# EAGLE design main (EAGLE 7.6.0)
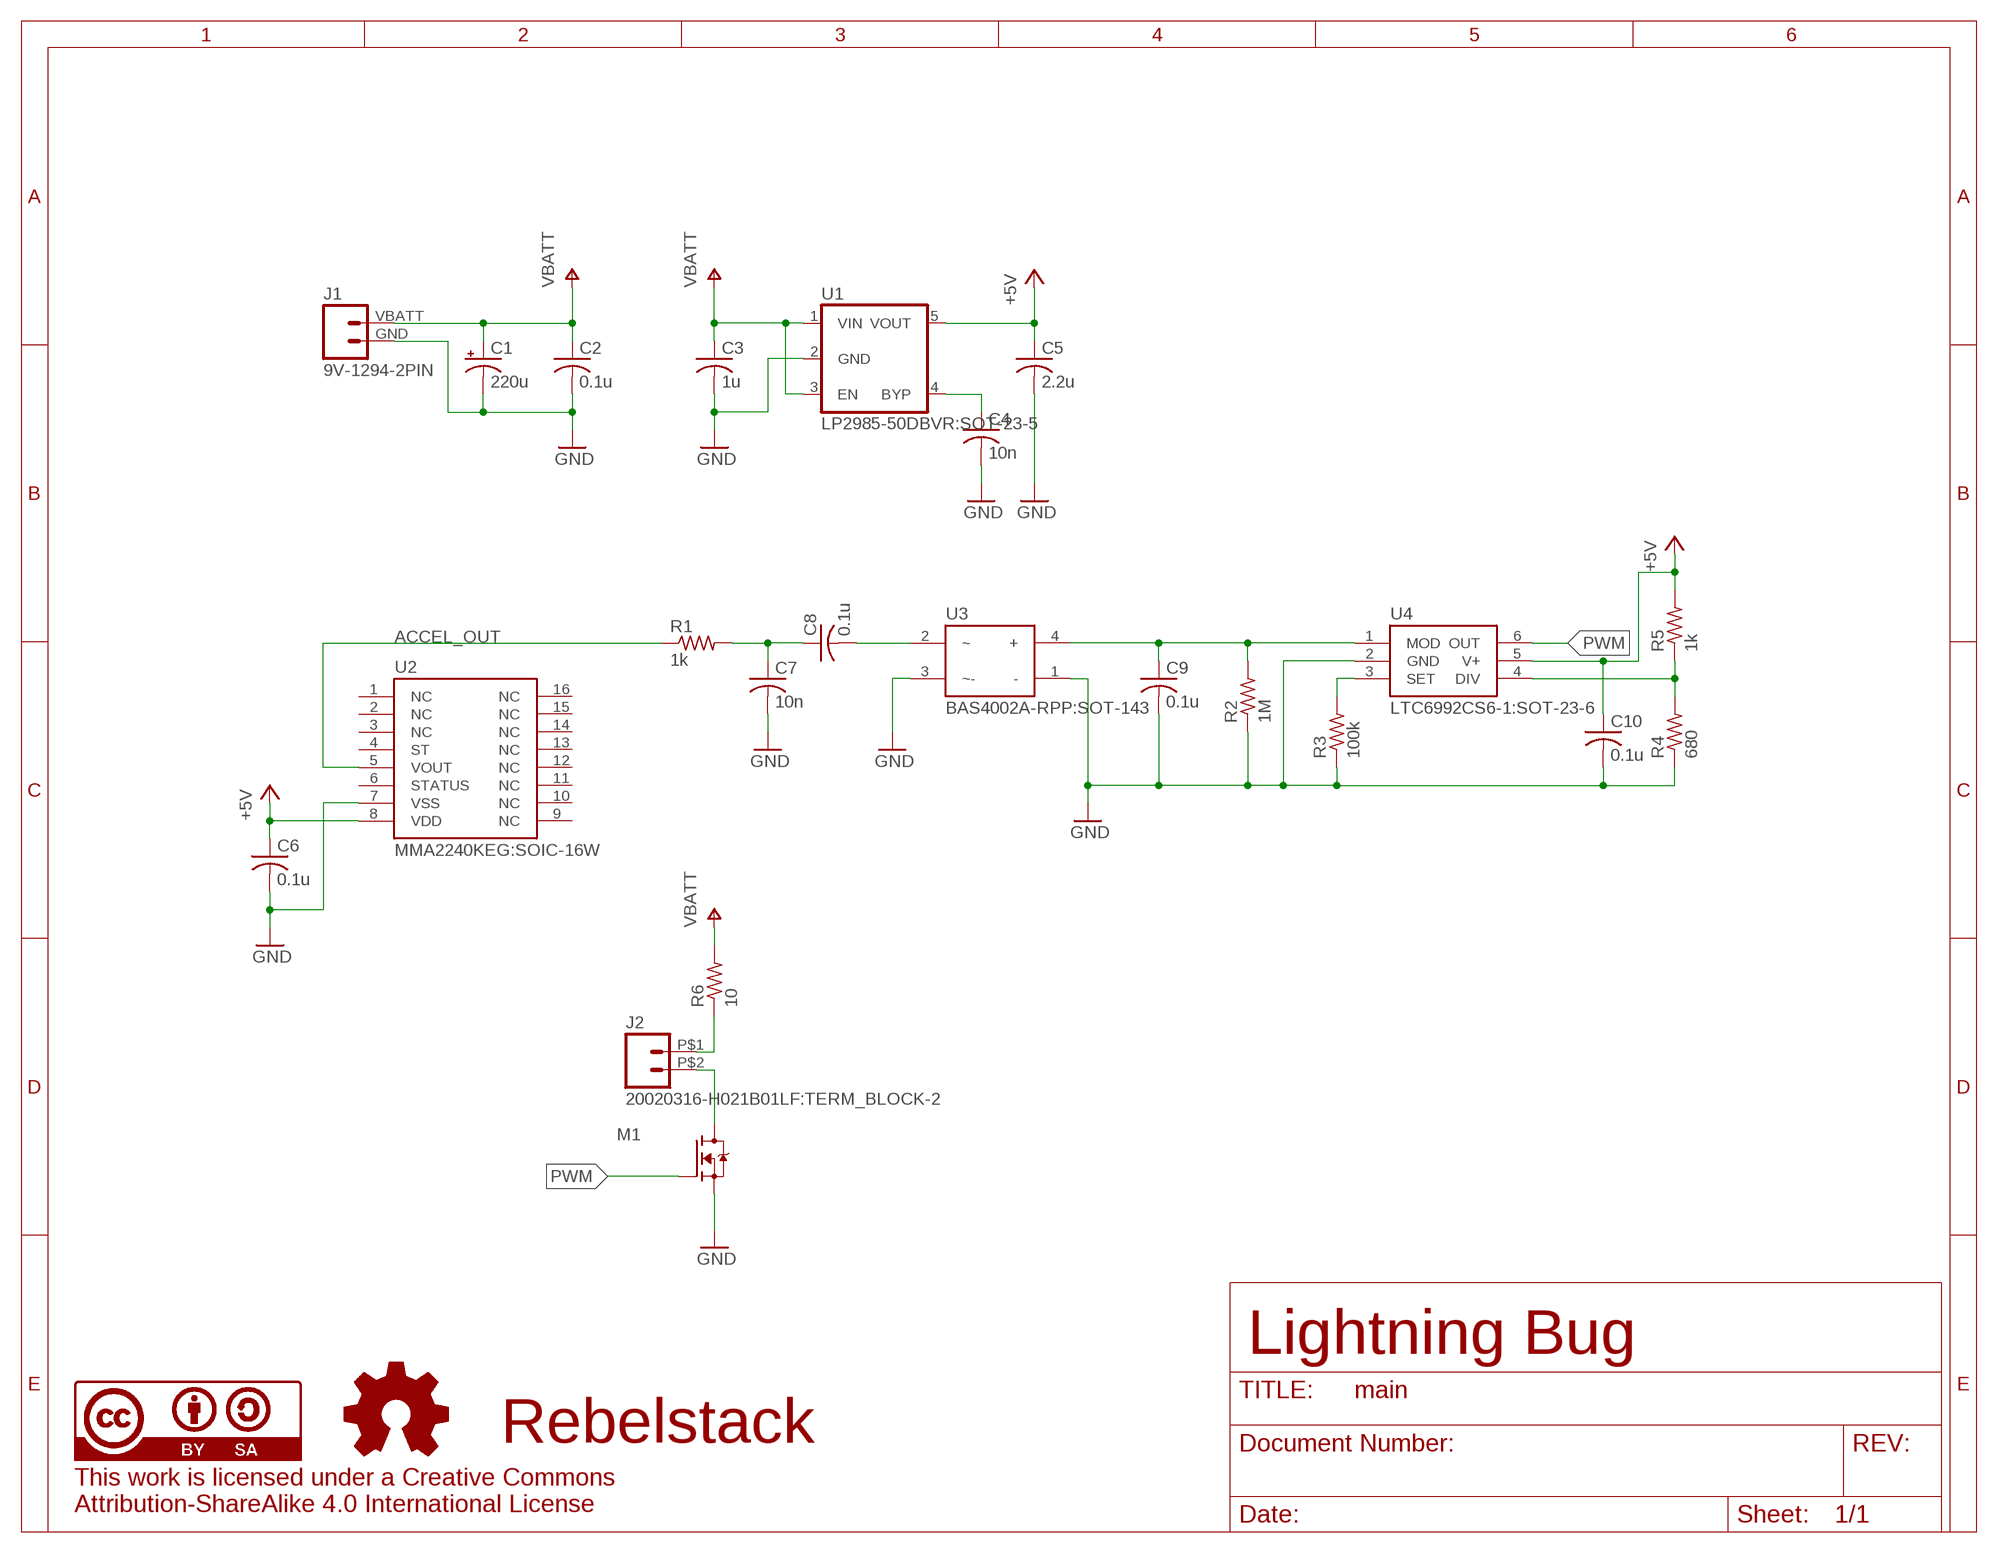
[diagram p0: schematic, sheet 1]

## Parts
C1  220u  CPOL-USD/7343-31W  [D/7343-31W]
C2  0.1u  C-USC0805  [C0805]
C3  1u  C-USC0805  [C0805]
C4  10n  C-USC0805  [C0805]
C5  2.2u  C-USC0805  [C0805]
C6  0.1u  C-USC0805  [C0805]
C7  10n  C-USC0805  [C0805]
C8  0.1u  C-USC0805  [C0805]
C9  0.1u  C-USC0805  [C0805]
C10  0.1u  C-USC0805  [C0805]
J1  9V-1294-2PIN  [9V-THRU]
J2  20020316-H021B01LF:TERM_BLOCK-2  [TERM_BLOCK-2]
M1  IRLML2502TRPBF:SOT-23-3  [SOT-23-3]
R1  1k  R-US_M0805  [M0805]
R2  1M  R-US_M0805  [M0805]
R3  100k  R-US_M0805  [M0805]
R4  680  R-US_M0805  [M0805]
R5  1k  R-US_M0805  [M0805]
R6  10  R-US_R2512  [R2512]
U1  LP2985-50DBVR:SOT-23-5  [SOT-23-5]
U2  MMA2240KEG:SOIC-16W  [SOIC-16W]
U3  BAS4002A-RPP:SOT-143  [SOT-143]
U4  LTC6992CS6-1:SOT-23-6  [SOT-23-6]
U$4  CC-BY-SA-4.0-INT-PCB  [CC-BY-SA-4.0-INT]
U$5  OSHW-LOGO-PCB  [OSHW-LOGO]

## Nets
+5V: C5.1 C6.1 C10.1 R5.2 U1.5(VOUT) U2.8(VDD) U4.5(V+)
ACCEL_OUT: R1.1 U2.5(VOUT)
GND: C1.- C2.2 C3.2 C4.2 C5.2 C6.2 C7.2 C9.2 C10.2 J1.GND M1.2(S) R2.1 R3.1 R4.1 U1.2(GND) U2.7(VSS) U3.1(-) U3.3(~-) U4.2(GND)
N$1: C4.1 U1.4(BYP)
N$2: C8.2 U3.2(~)
N$3: C9.1 R2.2 U3.4(+) U4.1(MOD)
N$4: R4.2 R5.1 U4.4(DIV)
N$5: C7.1 C8.1 R1.2
N$6: J2.P$1 R6.1
N$7: R3.2 U4.3(SET)
N$8: J2.P$2 M1.3(D)
PWM: M1.1(G) U4.6(OUT)
VBATT: C1.+ C2.1 C3.1 J1.VBATT R6.2 U1.1(VIN) U1.3(EN)
Unconnected: U2.1(NC) U2.2(NC) U2.3(NC) U2.4(ST) U2.6(STATUS) U2.9(NC) U2.10(NC) U2.11(NC) U2.12(NC) U2.13(NC) U2.14(NC) U2.15(NC) U2.16(NC)

## Notes on the sheet
- Lightning Bug
- Rebelstack

## Library data of the parts
C1 = rcl:CPOL-US: POLARIZED CAPACITOR, American symbol; DISTRIBUTOR: Digi-key; DISTRIBUTOR_PN: 399-10429-1-ND
C2 C6 C8-C10 = rcl:C-US: CAPACITOR, American symbol; DISTRIBUTOR: Digi-key; DISTRIBUTOR_PN: 1276-1007-1-ND
C3 = rcl:C-US: CAPACITOR, American symbol; DISTRIBUTOR: Digi-key; DISTRIBUTOR_PN: 1276-1066-1-ND
C4 C7 = rcl:C-US: CAPACITOR, American symbol; DISTRIBUTOR: Digi-key; DISTRIBUTOR_PN: 311-1136-1-ND
C5 = rcl:C-US: CAPACITOR, American symbol; DISTRIBUTOR: Digi-key; DISTRIBUTOR_PN: 445-1420-1-ND
J1 = rebelStack:9V-1294-2PIN: 9V Battery Holder, Thru-hole; DISTRIBUTOR: Digi-key; DISTRIBUTOR_PN: 36-1294-ND
J2 = rebelStack:20020316-H021B01LF:TERM_BLOCK-2: 2-Lead Terminal Block, Amphenol FCI, 0.2" Pitch, RA; DISTRIBUTOR: Digi-key; DISTRIBUTOR_PN: 609-3936-ND
M1 = rebelStack:IRLML2502TRPBF:SOT-23-3: N-Channel MOSFET, 20V, 4.2A, SOT-23; DISTRIBUTOR: Digi-key; DISTRIBUTOR_PN: IRLML2502PBFCT-ND
R1 R5 = rcl:R-US_: RESISTOR, American symbol; DISTRIBUTOR: Digi-key; DISTRIBUTOR_PN: 311-1.0KARCT-ND
R2 = rcl:R-US_: RESISTOR, American symbol; DISTRIBUTOR: Digi-key; DISTRIBUTOR_PN: 311-1.00MCRCT-ND
R3 = rcl:R-US_: RESISTOR, American symbol; DISTRIBUTOR: Digi-key; DISTRIBUTOR_PN: 311-100KCRCT-ND
R4 = rcl:R-US_: RESISTOR, American symbol; DISTRIBUTOR: Digi-key; DISTRIBUTOR_PN: 311-680ARCT-ND
R6 = rcl:R-US_: RESISTOR, American symbol; DISTRIBUTOR: Digi-key; DISTRIBUTOR_PN: CPA25Q10.0CT-ND
U1 = rebelStack:LP2985-50DBVR:SOT-23-5: 5V, 150-mA Low-noise Low-dropout Regulator With Shutdown, SOT-23-5; DISTRIBUTOR: Digi-key; DISTRIBUTOR_PN: 296-20717-1-ND
U2 = rebelStack:MMA2240KEG:SOIC-16W: +/- 7g X-axis Analog Accelerometer, SOIC-16W; DISTRIBUTOR: Digi-key; DISTRIBUTOR_PN: MMA2240KEG-ND
U3 = rebelStack:BAS4002A-RPP:SOT-143: Low VF Schottky Diode Array, Bridge Rectifier; DISTRIBUTOR: Digi-key; DISTRIBUTOR_PN: BAS4002ARPPE6327INCT-ND
U4 = rebelStack:LTC6992CS6-1:SOT-23-6: Voltage Controlled Pulse Width Modulator, SOT-23-6; DISTRIBUTOR: Digi-key; DISTRIBUTOR_PN: LTC6992CS6-1#TRMPBFCT-ND
U$4 = rebelStack:CC-BY-SA-4.0-INT-PCB: Creative Commons BY-SA-4.0 International License, Symbol and Silkscreen
U$5 = rebelStack:OSHW-LOGO-PCB: Open Source Hardware Logo, Symbol and Silkscreen

## Board
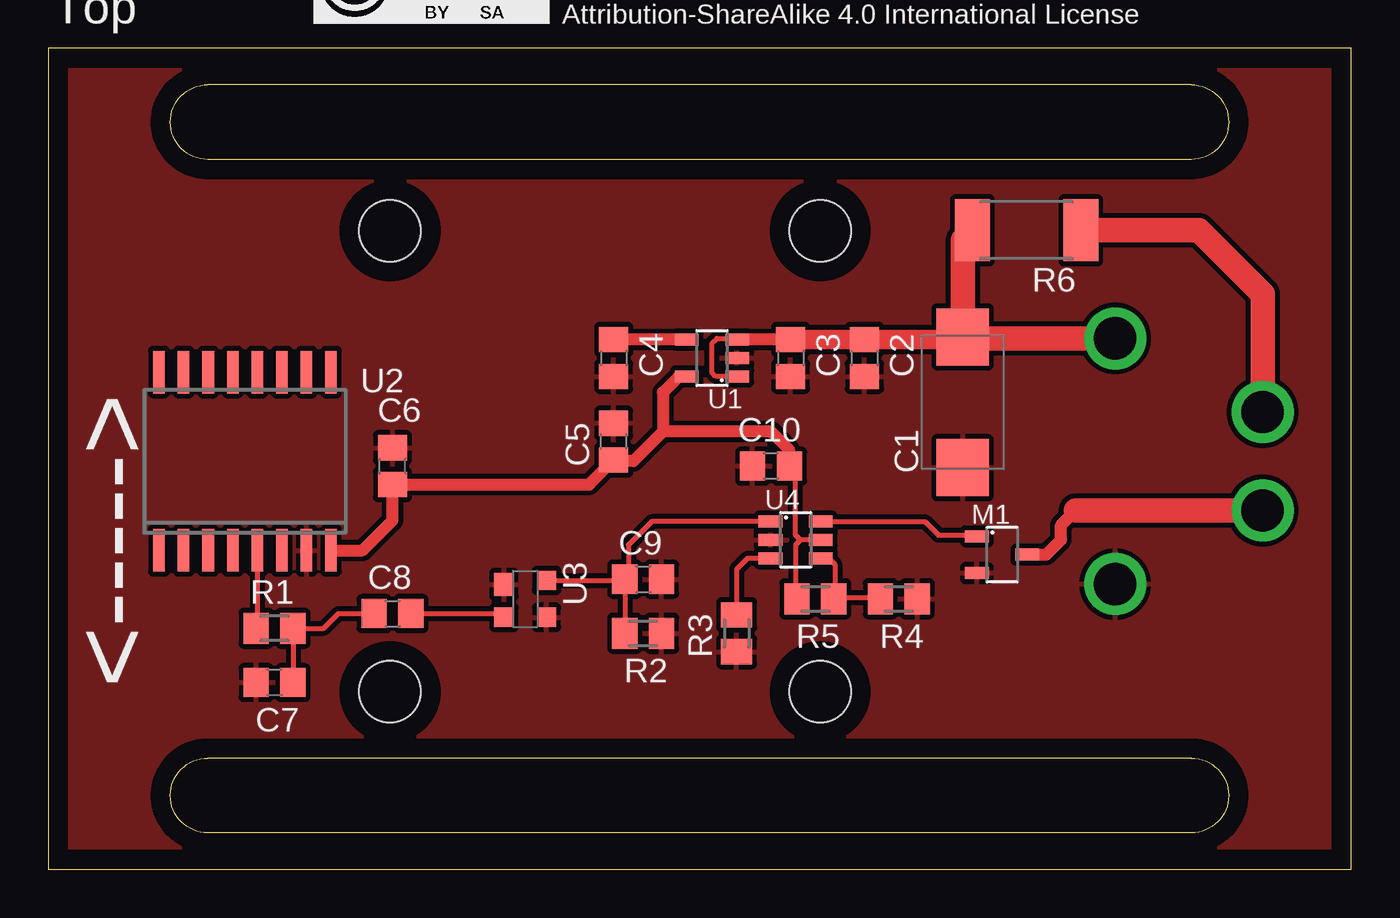
[diagram p1: board, top side]
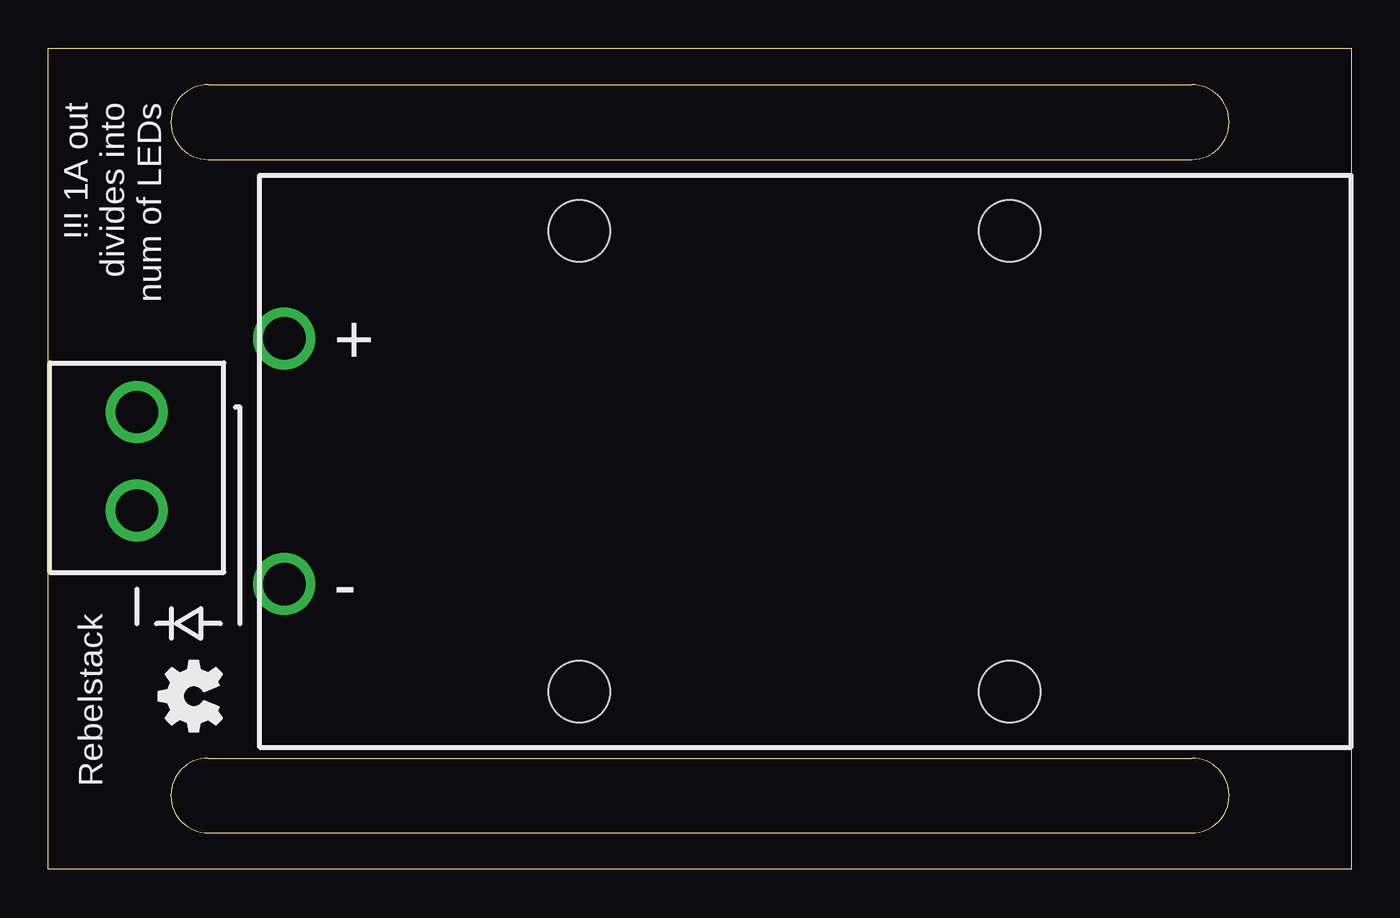
[diagram p2: board, bottom side, seen from below]

Size 67.31 x 42.42 mm. Coordinates in mm from the lower left corner, seen from the top.
Outline: 0,0 67.31,0 67.31,42.42 0,42.42 0,0
Outline: 8.23,1.88 arc-180 8.23,5.74 59.05,5.74 arc-180 59.05,1.88 8.23,1.88
Outline: 8.23,36.68 arc-180 8.23,40.54 59.05,40.54 arc-180 59.05,36.68 8.23,36.68
Copper layers (1*16): Top 0.035mm / dielectric 1.5mm / Bottom 0.035mm
Design rules "default *": minimum track width 10mil, minimum drill 24mil, track to track 10mil, track to pad 10mil, pad to pad 10mil, via to via 10mil, smd to smd 10mil, copper to edge 40mil, drill to drill 10mil, minimum pad ring 10mil, minimum via ring 8mil, stop-mask expansion 4mil, vias tented up to drill 0mil, thermal gap 10mil

### Footprints (pad centres in the part's own frame; a part is rotated, then mirrored left to right if it is on the bottom)
D/7343-31W = smd 2.95 x 2.7: + 3.375,0; - -3.375,0
C0805 = smd 1.3 x 1.5: 1 -0.95,0; 2 0.95,0
9V-THRU = drill 2.184: GND 0,-6.35; VBATT 0,6.35 | hole 3.175: 15.24,-11.913; 37.465,11.913; 15.24,11.913; 37.465,-11.913
TERM_BLOCK-2 = drill 2.184: P$1 0,2.54; P$2 0,-2.54
SOT-23-3 = smd 0.62 x 1.22: 1 -0.95,-1.3; 2 0.95,-1.3; 3 0,1.3
M0805 = smd 1.3 x 1.6: 1 -0.95,0; 2 0.95,0
R2512 = smd 1.8 x 3.2: 1 -2.8,0; 2 2.8,0
SOT-23-5 = smd 0.62 x 1.22: 1 -0.95,-1.3; 2 0,-1.3; 3 0.95,-1.3; 4 0.95,1.3; 5 -0.95,1.3
SOIC-16W = smd 0.6 x 2.2: 1 -4.445,-4.6; 2 -3.175,-4.6; 3 -1.905,-4.6; 4 -0.635,-4.6; 5 0.635,-4.6; 6 1.905,-4.6; 7 3.175,-4.6; 8 4.445,-4.6; 9 4.445,4.6; 10 3.175,4.6; 11 1.905,4.6; 12 0.635,4.6; 13 -0.635,4.6; 14 -1.905,4.6; 15 -3.175,4.6; 16 -4.445,4.6
SOT-143 = smd 1.2 x 1: 1 -0.75,-1.1 | smd 1 x 1: 2 0.95,-1.1; 3 0.95,1.1; 4 -0.95,1.1
SOT-23-6 = smd 0.62 x 1.22: 1 -0.95,-1.3; 2 0,-1.3; 3 0.95,-1.3; 4 0.95,1.3; 5 0,1.3; 6 -0.95,1.3

### Placement (x,y rotation side)
C1  47.24,24.13 90 top
C2  42.16,26.42 270 top
C3  38.35,26.42 270 top
C4  29.21,26.42 270 top
C5  29.21,22.1 90 top
C6  17.78,20.83 90 top
C7  11.68,9.65 180 top
C8  17.78,13.21 0 top
C9  30.73,14.99 0 top
C10  37.34,20.83 180 top
J1  55.12,21.08 0 bottom
J2  62.74,21.08 0 bottom
M1  49.28,16.26 270 top
R1  11.68,12.45 0 top
R2  30.73,12.19 180 top
R3  35.56,12.19 90 top
R4  43.94,13.97 180 top
R5  39.62,13.97 180 top
R6  50.55,33.02 180 top
U1  34.29,26.42 90 top
U2  10.16,21.08 0 top
U3  24.64,13.97 270 top
U4  38.61,17.02 270 top
U$4  13.72,43.69 0 top
U$5  58.17,7.11 90 bottom

### Tracks (layer width: path | path; a pad name or v marks a point on that pad's centre or on a via)
+5V
  Top 0.254: U4.5 38.86,17.02 | 38.86,17.02 38.61,17.27 38.61,20.51 C10.1 | 38.86,17.02 38.61,16.76 38.61,14.04 R5.2
  Top 0.61: U2.8 16.23,16.48 17.78,18.03 C6.1 27.94,19.88 C5.1 29.28,21.08 30.23,21.08 31.75,22.61 | C10.1 38.29,21.66 37.34,22.61 31.75,22.61 | U1.5 32.58,25.47 31.75,24.64 31.75,22.61
ACCEL_OUT
  Top 0.254: U2.5 10.79,12.51 R1.1
GND
  pour Top: 0.51,0.51 66.8,0.51 66.8,41.91 0.51,41.91
N$1
  Top 0.61: U1.4 C4.1
N$2
  Top 0.254: C8.2 23.35,13.21 U3.2
N$3
  Top 0.254: U3.4 29.72,14.92 C9.1 | C9.1 R2.2 | U4.1 31.18,17.97 29.97,16.76 29.97,15.17 C9.1
N$4
  Top 0.254: U4.4 40.32,16.07 40.64,15.75 40.64,14.04 | 40.64,14.04 R5.1 | 40.64,14.04 42.93,14.04 R4.2
N$5
  Top 0.254: C7.1 R1.2 14.22,12.45 14.99,13.21 C8.1
N$6
  Top 1.27: R6.1 59.44,33.02 62.74,29.72 J2.P$1
N$7
  Top 0.254: U4.3 36.13,16.07 35.56,15.49 R3.2
N$8
  Top 0.61: M1.3 51.56,16.26 52.32,17.02 52.32,17.78 53.09,18.54
  Top 1.27: 53.09,18.54 J2.P$2
PWM
  Top 0.254: U4.6 45.28,17.97 45.97,17.27 47.91,17.27 M1.1
VBATT
  Top 0.254: U1.1 34.48,25.47 34.29,25.65 34.29,27.18 34.54,27.43 35.52,27.43 U1.3
  Top 0.61: C3.1 U1.3
  Top 1.016: C1.+ 47.1,27.37 C2.1 C3.1
  Top 1.27: J1.VBATT 47.32,27.43 C1.+ 47.24,32.52 R6.2

### Text on the board
tPlace: Top | <----->
bPlace: !!! 1A out / divides into / num of LEDs | Rebelstack